# EAGLE design sensor garis (EAGLE 7.1.0)
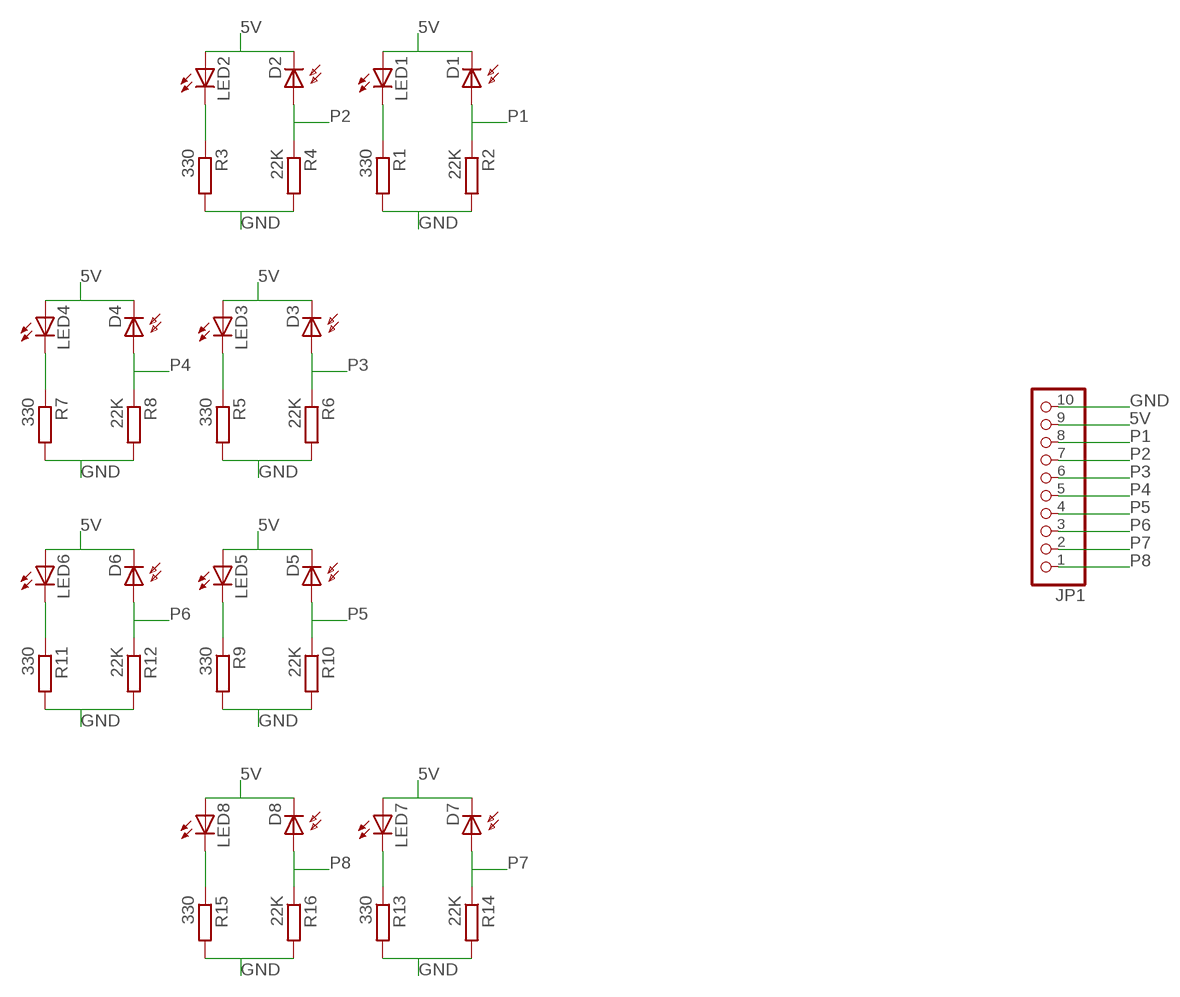
[diagram p0: schematic, sheet 1]

## Parts
D1  BPX65  [BPX65]
D2  BPX65  [BPX65]
D3  BPX65  [BPX65]
D4  BPX65  [BPX65]
D5  BPX65  [BPX65]
D6  BPX65  [BPX65]
D7  BPX65  [BPX65]
D8  BPX65  [BPX65]
JP1  PINHD-1X10  [1X10]
LED1  LED3MM  [LED3MM]
LED2  LED3MM  [LED3MM]
LED3  LED3MM  [LED3MM]
LED4  LED3MM  [LED3MM]
LED5  LED3MM  [LED3MM]
LED6  LED3MM  [LED3MM]
LED7  LED3MM  [LED3MM]
LED8  LED3MM  [LED3MM]
R1  330  R-EU_0207/7  [0207/7]
R2  22K  R-EU_0207/7  [0207/7]
R3  330  R-EU_0207/7  [0207/7]
R4  22K  R-EU_0207/7  [0207/7]
R5  330  R-EU_0207/7  [0207/7]
R6  22K  R-EU_0207/7  [0207/7]
R7  330  R-EU_0207/7  [0207/7]
R8  22K  R-EU_0207/7  [0207/7]
R9  330  R-EU_0207/7  [0207/7]
R10  22K  R-EU_0207/7  [0207/7]
R11  330  R-EU_0207/7  [0207/7]
R12  22K  R-EU_0207/7  [0207/7]
R13  330  R-EU_0207/7  [0207/7]
R14  22K  R-EU_0207/7  [0207/7]
R15  330  R-EU_0207/7  [0207/7]
R16  22K  R-EU_0207/7  [0207/7]

## Nets
5V: D1.K(C) D2.K(C) D3.K(C) D4.K(C) D5.K(C) D6.K(C) D7.K(C) D8.K(C) JP1.9 LED1.A LED2.A LED3.A LED4.A LED5.A LED6.A LED7.A LED8.A
GND: JP1.10 R1.2 R2.2 R3.2 R4.2 R5.2 R6.2 R7.2 R8.2 R9.2 R10.2 R11.2 R12.2 R13.2 R14.2 R15.2 R16.2
N$1: LED2.K(C) R3.1
N$2: LED1.K(C) R1.1
N$3: LED3.K(C) R5.1
N$4: LED4.K(C) R7.1
N$5: LED5.K(C) R9.1
N$6: LED6.K(C) R11.1
N$7: LED7.K(C) R13.1
N$8: LED8.K(C) R15.1
P1: D1.A JP1.8 R2.1
P2: D2.A JP1.7 R4.1
P3: D3.A JP1.6 R6.1
P4: D4.A JP1.5 R8.1
P5: D5.A JP1.4 R10.1
P6: D6.A JP1.3 R12.1
P7: D7.A JP1.2 R14.1
P8: D8.A JP1.1 R16.1

## Library data of the parts
D1-D8 = opto-trans-siemens:BPX65: PHOTO DIODE; MPN: BPX65.; OC_FARNELL: 327451; OC_NEWARK: 06WX2764
JP1 = pinhead:PINHD-1X10: PIN HEADER
LED1-LED8 = led:LED: LED OSRAM: - CHIPLED LG R971, LG N971, LY N971, LG Q971, LY Q971, LO R971, LY R971 LH N974, LH R974 LS Q976, LO Q976, LY Q976 LO Q996 - Hyper CHIPLED LW Q18S LB Q993, LB Q99A, LB R99A - SideLED LS A670, LO A670, LY A670, LG A670, LP A670 LB A673, LV A673, LT A673, LW A673 LH A674 LY A675 LS A676, LA A676, LO A676, LY A676, LW A676 LS A679, LY A679, LG A679 - Hyper Micro SIDELED® LS Y876, LA Y876, LO Y876, LY Y876 LT Y87S - SmartLED LW L88C, LW L88S LB L89C, LB L89S, LG L890 LS L89K, LO L89K, LY L89K LS L896, LA L896, LO L896, LY L896 - TOPLED LS T670, LO T670, LY T670, LG T670, LP T670 LSG T670, LSP T670, LSY T670, LOP T670, LYG T670 LG T671, LOG T671, LSG T671 LB T673, LV T673, LT T673, LW T673 LH T674 LS T676, LA T676, LO T676, LY T676, LB T676, LH T676, LSB T676, LW T676 LB T67C, LV T67C, LT T67C, LS T67K, LO T67K, LY T67K, LW E67C LS E67B, LA E67B, LO E67B, LY E67B, LB E67C, LV E67C, LT E67C LW T67C LS T679, LY T679, LG T679 LS T770, LO T770, LY T770, LG T770, LP T770 LB T773, LV T773, LT T773, LW T773 LH T774 LS E675, LA E675, LY E675, LS T675 LS T776, LA T776, LO T776, LY T776, LB T776 LHGB T686 LT T68C, LB T68C - Hyper Mini TOPLED® LB M676 - Mini TOPLED Santana® LG M470 LS M47K, LO M47K, LY M47K Source: http://www.osram.convergy.de LUXEON: - LUMILED® LXK2-PW12-R00, LXK2-PW12-S00, LXK2-PW14-U00, LXK2-PW14-V00 LXK2-PM12-R00, LXK2-PM12-S00, LXK2-PM14-U00 LXK2-PE12-Q00, LXK2-PE12-R00, LXK2-PE12-S00, LXK2-PE14-T00, LXK2-PE14-U00 LXK2-PB12-K00, LXK2-PB12-L00, LXK2-PB12-M00, LXK2-PB14-N00, LXK2-PB14-P00, LXK2-PB14-Q00 LXK2-PR12-L00, LXK2-PR12-M00, LXK2-PR14-Q00, LXK2-PR14-R00 LXK2-PD12-Q00, LXK2-PD12-R00, LXK2-PD12-S00 LXK2-PH12-R00, LXK2-PH12-S00 LXK2-PL12-P00, LXK2-PL12-Q00, LXK2-PL12-R00 Source: www.luxeon.com KINGBRIGHT: KA-3528ASYC Source: www.kingbright.com
R1-R16 = rcl:R-EU_: RESISTOR, European symbol

## Board
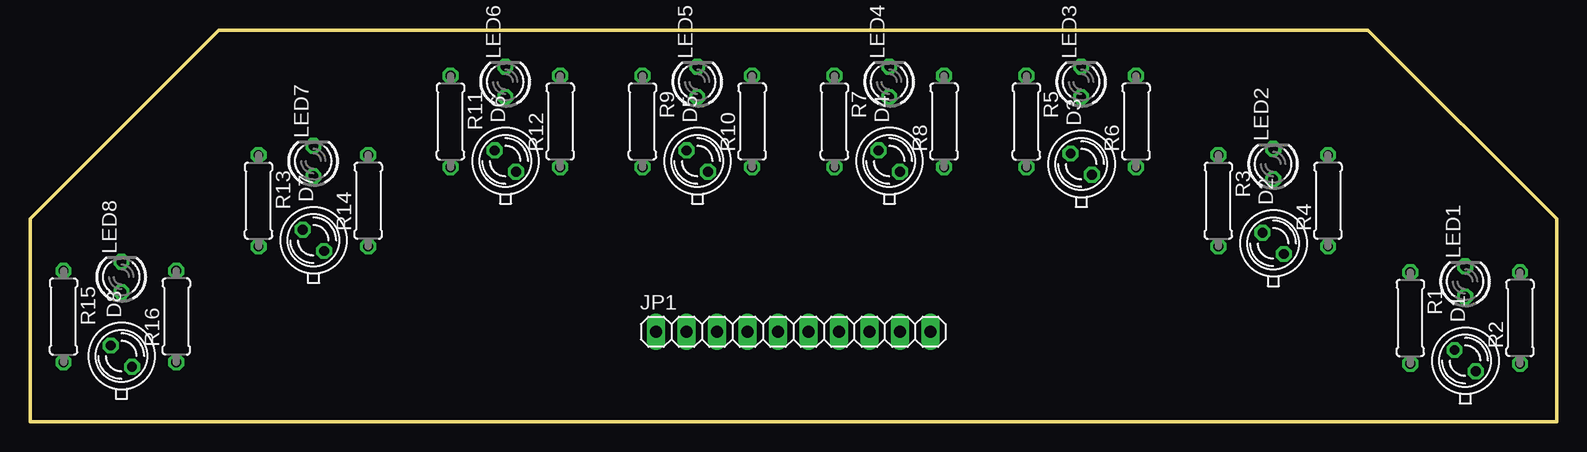
[diagram p1: board, top side]
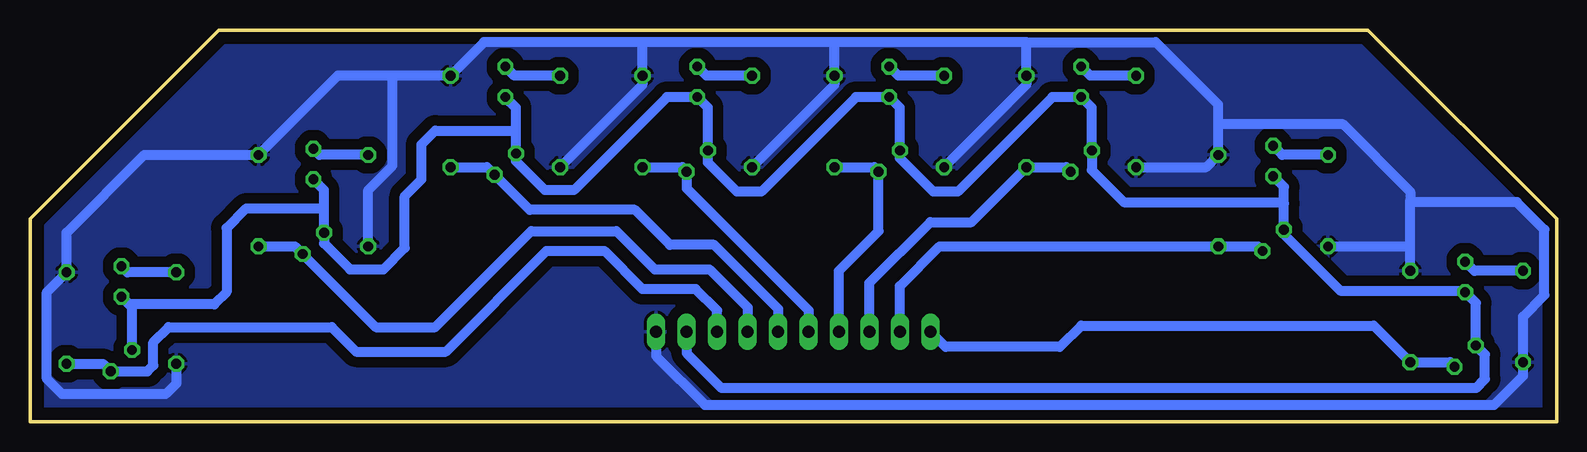
[diagram p2: board, bottom side, seen from below]

Size 127.25 x 32.64 mm. Coordinates in mm from the lower left corner, seen from the top.
Outline: 0,0 127.25,0 127.25,16.89 111.51,32.64 15.75,32.64 0,16.89 0,0
Copper layers (1*16): Top 0.035mm / dielectric 1.5mm / Bottom 0.035mm
Design rules "default *": minimum track width 10mil, minimum drill 24mil, track to track 35mil, track to pad 35mil, pad to pad 8mil, via to via 8mil, smd to smd 8mil, copper to edge 40mil, drill to drill 8mil, minimum pad ring 10mil, minimum via ring 8mil, stop-mask expansion 4mil, vias tented up to drill 0mil, thermal gap 10mil

### Footprints (pad centres in the part's own frame; a part is rotated, then mirrored left to right if it is on the bottom)
BPX65 = drill 0.813 octagon: A -0.889,-0.889; K 0.889,0.889
1X10 = drill 1.016 long: 1 -11.43,0; 2 -8.89,0; 3 -6.35,0; 4 -3.81,0; 5 -1.27,0; 6 1.27,0; 7 3.81,0; 8 6.35,0; 9 8.89,0; 10 11.43,0
LED3MM = drill 0.813 octagon: A -1.27,0; K 1.27,0
0207/7 = drill 0.813 octagon: 1 -3.81,0; 2 3.81,0

### Placement (x,y rotation side)
D1  119.63,5.08 90 top
D2  103.63,14.86 90 top
D3  87.63,21.46 90 top
D4  71.63,21.72 90 top
D5  55.63,21.72 90 top
D6  39.62,21.72 90 top
D7  23.62,15.11 90 top
D8  7.62,5.46 90 top
JP1  63.63,7.49 0 top
LED1  119.63,11.68 90 top
LED2  103.63,21.46 90 top
LED3  87.63,28.32 90 top
LED4  71.63,28.32 90 top
LED5  55.63,28.32 90 top
LED6  39.62,28.32 90 top
LED7  23.62,21.72 90 top
LED8  7.62,12.06 90 top
R1  115.06,8.64 270 top
R2  124.21,8.64 90 top
R3  99.06,18.41 270 top
R4  108.2,18.41 90 top
R5  83.06,25.02 270 top
R6  92.2,25.02 90 top
R7  67.06,25.02 270 top
R8  76.2,25.02 90 top
R9  51.05,25.02 270 top
R10  60.2,25.02 90 top
R11  35.05,25.02 270 top
R12  44.2,25.02 90 top
R13  19.05,18.41 270 top
R14  28.19,18.41 90 top
R15  2.79,8.76 270 top
R16  12.19,8.76 90 top

### Tracks (layer width: path | path; a pad name or v marks a point on that pad's centre or on a via)
5V
  Bottom 0.813: 22.73,18.16 D7.K 22.73,15.62 18.03,10.92 7.75,10.92 LED8.A 6.73,9.91 D8.K 5.97,5.59 5.97,3.56 6.73,2.79 69.6,2.79 72.52,5.71 JP1.9 | 22.73,18.16 22.73,19.56 LED7.A | 86.74,24.51 D3.K 86.74,21.72 84.33,19.3 81.91,19.3 74.17,27.05 LED4.A 70.74,26.16 D4.K 70.74,21.59 68.33,19.18 66.29,19.18 58.42,27.05 LED5.A 54.74,26.16 D5.K 54.74,21.97 51.94,19.18 49.91,19.18 42.04,27.05 LED6.A 38.73,26.16 D6.K 38.73,20.95 36.07,18.29 22.86,18.29 22.73,18.16 | 86.74,24.51 86.74,26.16 LED3.A | 102.74,17.91 D2.K 102.74,14.86 100.58,12.7 97.79,12.7 96.01,14.48 96.01,18.8 94.61,20.19 94.61,23.11 93.47,24.26 86.99,24.26 86.74,24.51 | 102.74,17.91 102.74,19.3 LED2.A | 102.74,17.91 102.87,17.78 109.22,17.78 110.87,16.13 110.87,10.79 111.89,9.78 118.74,9.78 | 118.74,9.78 119,9.78 LED1.A | D1.K 118.74,9.78
GND
  Bottom 0.813: 96.9,28.83 R6.2 89.41,31.62 76.2,31.62 | 96.9,28.83 101.6,28.83 R4.2 117.73,22.22 124.21,15.75 R2.2 125.86,10.79 125.86,3.56 124.59,2.29 115.95,2.29 115.06,3.17 R1.2 | 76.2,31.62 R8.2 76.2,28.07 R5.2 | 60.2,31.62 R10.2 60.2,28.07 R7.2 | 60.2,31.62 76.2,31.62 | 44.2,31.62 R12.2 44.2,28.07 R9.2 | 44.2,31.62 60.2,31.62 | R11.2 29.21,21.21 R14.2 28.19,24.77 | R3.2 99.06,19.3 97.03,21.34 97.03,28.7 96.9,28.83 | JP1.10 75.06,5.46 70.99,1.4 5.21,1.4 2.79,3.81 R15.2 2.79,8.76 1.02,10.54 1.02,16 3.3,18.29 12.06,18.29 | 44.2,31.62 33.4,31.62 28.19,26.42 28.19,24.77 | 28.19,24.77 17.78,24.77 12.19,19.18 12.19,18.41 12.06,18.29 | R16.2 12.19,14.73 | 12.19,14.73 12.19,18.16 12.06,18.29 | R13.2 12.32,14.6 12.19,14.73
  pour Bottom: 15.75,32.64 111.51,32.64 127.25,16.89 127.25,0 0,0 0,16.89
N$1
  Bottom 0.813: R3.1 103.12,22.22 LED2.K
N$2
  Bottom 0.813: R1.1 119.13,12.45 LED1.K
N$3
  Bottom 0.813: R5.1 86.87,28.83 LED3.K
N$4
  Bottom 0.813: R7.1 70.87,28.83 LED4.K
N$5
  Bottom 0.813: R9.1 54.86,28.83 LED5.K
N$6
  Bottom 0.813: R11.1 38.86,28.83 LED6.K
N$7
  Bottom 0.813: R13.1 22.86,22.22 LED7.K
N$8
  Bottom 0.813: R15.1 6.86,12.57 LED8.K
P1
  Bottom 0.813: JP1.8 69.98,9.27 71.75,11.05 76.2,11.05 79.38,14.22 84.2,14.22 92.58,5.84 100.08,5.84 102.11,7.87 115.7,7.87 116.97,6.6 116.97,4.7 117.47,4.19 D1.A 121.16,4.83 R2.1
P2
  Bottom 0.813: R4.1 105.16,14.6 D2.A 98.42,7.87 93.47,7.87 85.47,15.88 78.36,15.88 75.18,12.7 70.61,12.7 67.44,9.52 JP1.7
P3
  Bottom 0.813: R6.1 89.15,21.21 D3.A | D3.A 88.39,20.57 | JP1.6 64.9,9.4 70.23,14.73 73.91,14.73 76.83,17.65 85.6,17.65 D3.A
P4
  Bottom 0.813: R8.1 72.9,21.21 D4.A 72.52,19.43 62.36,9.27 JP1.5
P5
  Bottom 0.813: R10.1 56.9,21.21 D5.A 56.52,15.88 59.82,12.57 JP1.4
P6
  Bottom 0.813: D6.A 40.89,21.21 R12.1 48.77,16.64 52.2,16.64 57.28,11.56 JP1.3
P7
  Bottom 0.813: D7.A 24.89,14.6 R14.1 51.44,14.6 54.74,11.3 JP1.2
P8
  Bottom 0.813: JP1.1 50.93,6.22 41.4,6.22 39.62,8 15.24,8 R16.1 8.89,4.95 D8.A